# EasyEDA schematic 1-Schematic_LNA (SMD).json
TITLE: LNA (SMD): Main module; REV: 2.0.EE; Date: 2019-12-26; Sheet: 1/1; Drawn By: IgrikXD
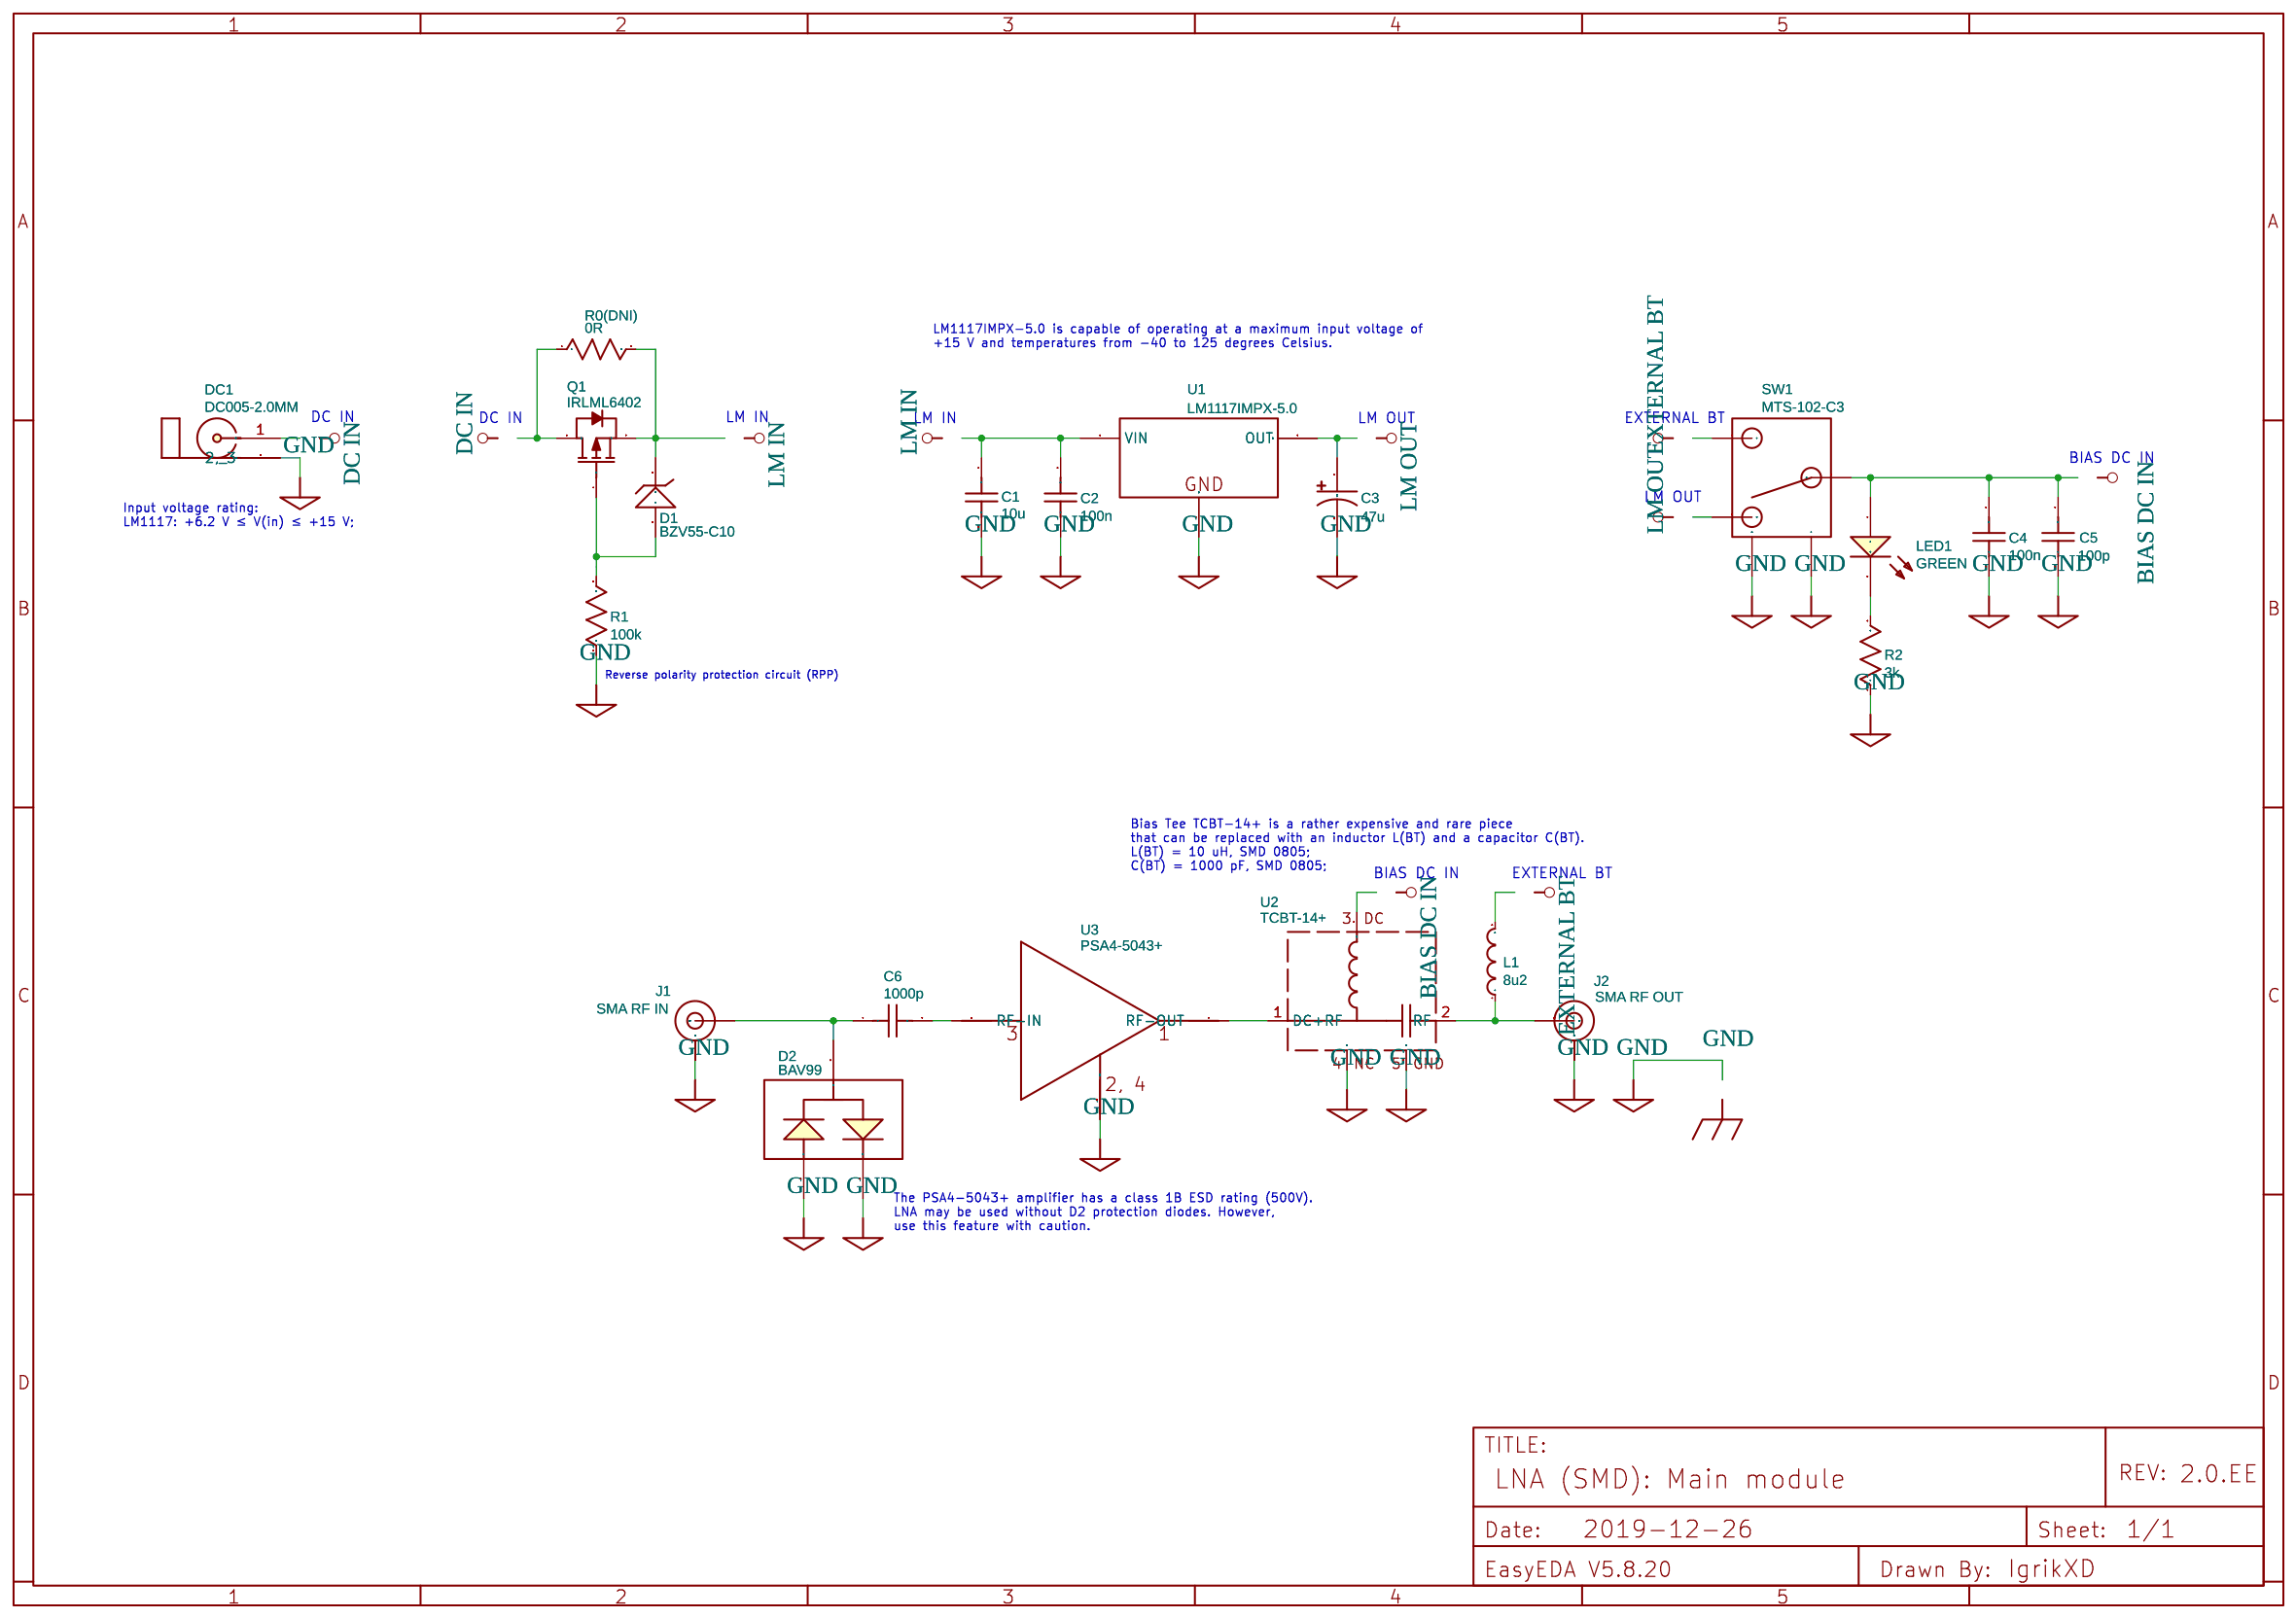
[diagram p0: schematic sheet]

## Parts
C1  10u  [0805]
C2  100n  [0805]
C3  47u  [CASE-B_3528]
C4  100n  [0805]
C5  100p  [0805]
C6  1000p  [0805]
D1  BZV55-C10  [SOD-80C]
D2  BAV99  [SOT-23-3]
DC1  DC005-2.0MM  [DC-5020]
J1  SMA RF IN  [SMA-EDGE]
J2  SMA RF OUT  [SMA-EDGE]
L1  8u2  [0805]
LED1  GREEN  [LED-0805]
Q1  IRLML6402  [SOT-23(SOT-23-3)]
R0(DNI)  0R  [0805]
R1  100k  [0805]
R2  3k  [0805]
SW1  MTS-102-C3  [MTS-102-C3]
U1  LM1117IMPX-5.0  [SOT223]
U2  TCBT-14+  [GU1414 (SPCB)]
U3  PSA4-5043+  [MMM1362 (SPCB)]

## Library data of the parts
C1 = Capacitor: Manufacturer Part: CL21A106KAYNNNE; Supplier: LCSC; Manufacturer: Samsung Electro-Mechanics; Supplier Part: C15850
C2 C4 = Capacitor: Manufacturer Part: 08055C104JAT2A; Supplier: LCSC; Manufacturer: AVX; Supplier Part: C129175
C3 = Cap_Electrolytic(TH)_D3.0XF1.5_US: Manufacturer Part: TAJB476K010RNJ; Supplier: LCSC; Supplier Part: C22036; Manufacturer: AVX
C5 = Capacitor: Manufacturer Part: C2012C0G2A101JT000N; Supplier: LCSC; Manufacturer: TDK; Supplier Part: C76633
C6 = Capacitor: Manufacturer Part: CC0805FRNPO9BN102; Supplier: LCSC; Manufacturer: YAGEO; Supplier Part: C326587
D1 = -: catid: 20; Supplier: LCSC; Manufacturer: NXP Semicon; Supplier Part: C108431
D2 = -: Supplier: LCSC; Manufacturer: SEMTECH; Contributor: IgrikXD; Supplier Part: C83868
DC1 = -: Supplier Part: C16214; Supplier: LCSC; Manufacturer: BOOMELE; Manufacturer Part: DC-005 5.5-2.0; Contributor: IgrikXD
J1 J2 = -: SMA Antenna Connector; Contributor: IgrikXD; Manufacturer Part: ?
L1 = Inductor: Supplier: LCSC; Manufacturer: Guangdong Fenghua Advanced Tech; Manufacturer Part: CMI201209X8R2KT; Supplier Part: C139233
LED1 = -: Supplier: LCSC; Manufacturer: EVERLIGHT; Manufacturer Part: 17-21/GHC-YR1S2/3T; Supplier Part: C73546
Q1 = -: Supplier: LCSC; Manufacturer: Infineon Technologies; Manufacturer Part: IRLML6402TRPBF; Supplier Part: C2593
R0(DNI) = Res_0805(1/8W)_US: Manufacturer Part: CR0805F80000G; Supplier Part: C101402; Supplier: LCSC; Manufacturer: LIZ Elec; Mounted: Yes
R1 = Resistor: Manufacturer Part: RC0805FR-07100KL; Supplier: LCSC; Manufacturer: YAGEO; Supplier Part: C96346
R2 = Resistor: Manufacturer Part: RC0805FR-073KL; Supplier: LCSC; Manufacturer: YAGEO; Supplier Part: C126350
SW1 = -: Contributor: snhunter; sourceId: LjTecMmIi
U1 = -: Contributor: IgrikXD; Manufacturer Part: LM1117IMPX-5.0/NOPB; Supplier: LCSC; Supplier Part: C41202; Manufacturer: Texas Instruments
U2 = -: sourceId: zhN5Zhasm; Contributor: IgrikXD; Supplier: Mini-Circuits; Manufacturer: Mini-Circuits
U3 = -: Contributor: IgrikXD; Supplier: Mini-Circuits; Manufacturer: Mini-Circuits

## Nets
GND: C1.2 C2.1 C3.2 C4.1 C5.1 D2.1 D2.2 DC1.2(2, 3) DC1.3 J1.GND@0(GND) J1.GND@1(GND) J1.GND@2(GND) J1.GND@3(GND) J2.GND@0(GND) J2.GND@1(GND) J2.GND@2(GND) J2.GND@3(GND) R1.1 R2.1 SW1.4 SW1.5 U1.1(ADJ) U2.4(NC) U2.5(GND) U3.2(GND) U3.4(GND)
BIAS DC IN: C4.2 C5.2 LED1.1(A) SW1.2 U2.3(DC)
DC IN: DC1.1(VCC) Q1.3(D) R0(DNI).1
EXTERNAL BT: L1.2 SW1.1
LM IN: C1.1 C2.2 D1.2(C) Q1.2(S) R0(DNI).2 U1.3(VIN)
LM OUT: C3.1 SW1.3 U1.2(OUT) U1.4(OUT)
Net-(C6-1): C6.1 D2.3 J1.SIG(SIGNAL)
Net-(C6-2): C6.2 U3.3(RF-IN)
Net-(D1-1): D1.1(A) Q1.1(G) R1.2
Net-(J2-SIG): J2.SIG(SIGNAL) L1.1 U2.2(RF)
Net-(LED1-2): LED1.2(C) R2.2
Net-(U2-1): U2.1(DC+RF) U3.1(RF-OUT)

## Notes on the sheet
- LM1117IMPX-5.0 is capable of operating at a maximum input voltage of
  +15 V and temperatures from -40 to 125 degrees Celsius.
- DC IN
- DC IN
- LM IN
- LM IN
- LM OUT
- EXTERNAL BT
- BIAS DC IN
- Input voltage rating:
  LM1117: +6.2 V ≤ V(in) ≤ +15 V;
- LM OUT
- Reverse polarity protection circuit (RPP)
- Bias Tee TCBT-14+ is a rather expensive and rare piece
  that can be replaced with an inductor L(BT) and a capacitor C(BT).
  L(BT) = 10 uH, SMD 0805;
  C(BT) = 1000 pF, SMD 0805;
- BIAS DC IN
- EXTERNAL BT
- The PSA4-5043+ amplifier has a class 1B ESD rating (500V).
  LNA may be used without D2 protection diodes. However,
  use this feature with caution.
